# Altium schematic sheet Motor Encoder+Driver.schdoc
size 285 x 152 mm
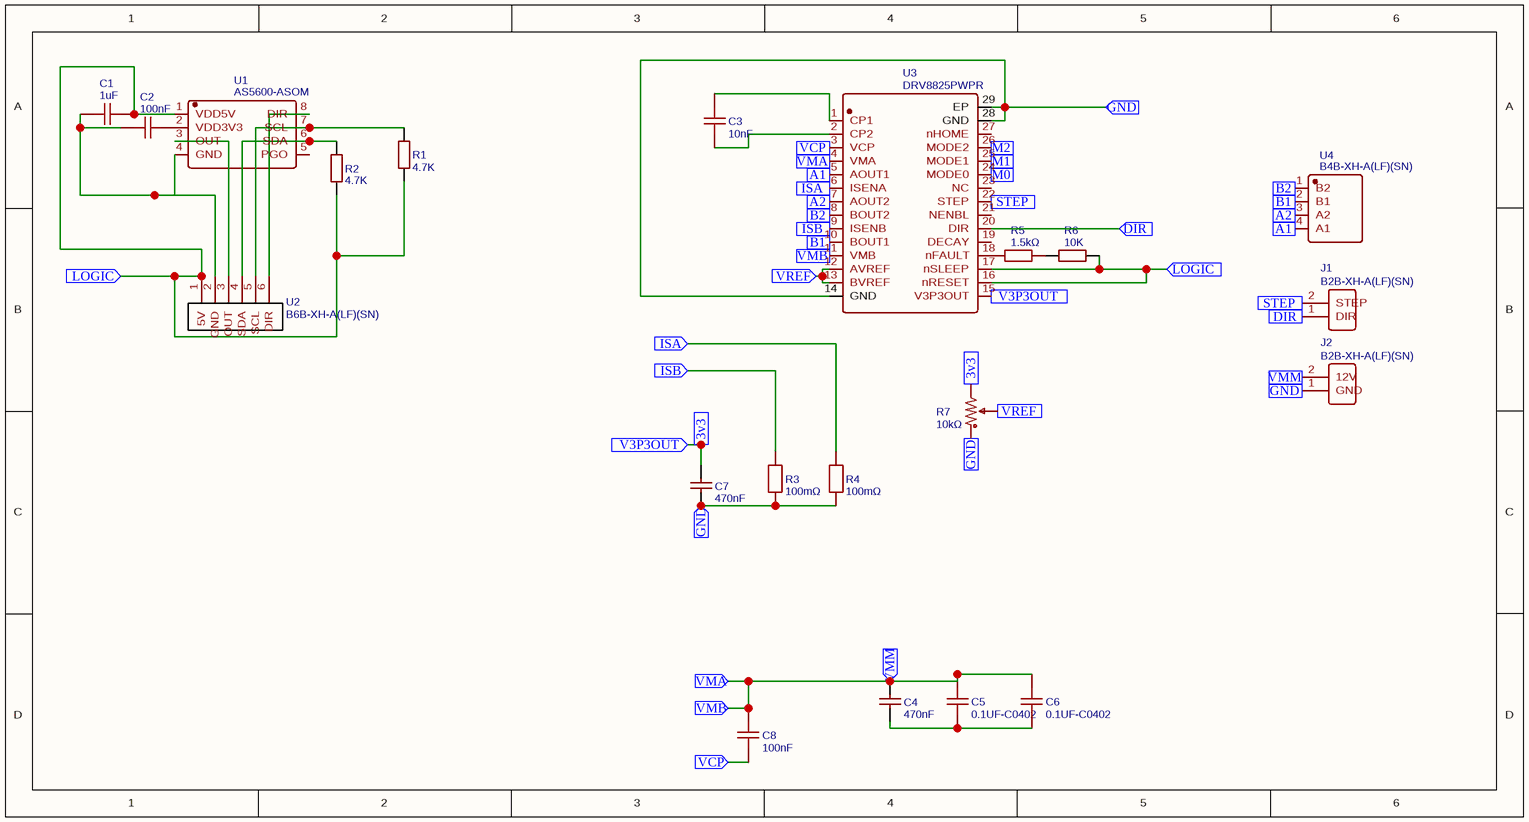
[diagram p0: Motor Encoder+Driver.schdoc]

## Parts
C1  1uF  [C0402]
C2  100nF  [C0402]
C3  10nF  [C0402]
C4  470nF  [C0402]
C5  0.1UF-C0402  [C0402]
C6  0.1UF-C0402  [C0402]
C7  470nF  [C0402]
C8  100nF  [C0402]
J1  B2B-XH-A(LF)(SN)  [CONN-TH_2P-P2.50_B2B-XH-A(LF)(SN)]
J2  B2B-XH-A(LF)(SN)  [CONN-TH_2P-P2.50_B2B-XH-A(LF)(SN)]
R1  4.7K  [R0603]
R2  4.7K  [R0603]
R3  100mΩ  [R0603]
R4  100mΩ  [R0603]
R5  1.5kΩ  [R0603]
R6  10K  [R0603]
R7  10kΩ  [RES-ADJ-SMD_3P-L3.0-W3.8-P1.75-BR]
U1  AS5600-ASOM  [SOIC-8_L5.0-W4.0-P1.27-LS6.0-BL]
U2  B6B-XH-A(LF)(SN)  [CONN-TH_6P-P2.50_B6B-XH-A-LF-SN]
U3  DRV8825PWPR  [HTSSOP-28_L9.7-W4.4-P0.65-LS6.4-BL-EP]
U4  B4B-XH-A(LF)(SN)  [CONN-TH_B4B-XH-A-LF-SN]

## Ports
3v3 (in), A1 (in), A2 (in), B1 (in), B2 (in), DIR (in), GND (in), ISA (in), ISB (in), LOGIC (in), M0 (in), M1 (in), M2 (in), STEP (in), V3P3OUT (in), VCP (in), VMA (in), VMB (in), VMM (in), VREF (in)

## Nets
3v3: C7.2 R7.3 U3.15(V3P3OUT) ; port 3v3, port V3P3OUT
A1: U3.5(AOUT1) U4.4(A1) ; port A1
A2: U3.7(AOUT2) U4.3(A2) ; port A2
B1: U3.10(BOUT1) U4.2(B1) ; port B1
B2: U3.8(BOUT2) U4.1(B2) ; port B2
DIR: J1.1(DIR) U3.20(DIR) ; port DIR
GND: C7.1 J2.1(GND) R3.1 R4.1 R7.1 U3.14(GND) U3.28(GND) U3.29(EP) ; port GND
ISA: R4.2 U3.6(ISENA) ; port ISA
ISB: R3.2 U3.9(ISENB) ; port ISB
LOGIC: C1.2 R1.2 R2.1 R6.2 U1.1(VDD5V) U2.1(5V) U3.16(nRESET) U3.17(nSLEEP) ; port LOGIC
M0: U3.24(MODE0) ; port M0
M1: U3.25(MODE1) ; port M1
M2: U3.26(MODE2) ; port M2
STEP: J1.2(STEP) U3.22(STEP) ; port STEP
VCP: C8.2 U3.3(VCP) ; port VCP
VMA: C4.2 C5.1 C6.1 C8.1 J2.2(12V) U3.4(VMA) U3.11(VMB) ; port VMM, port VMB, port VMA
VREF: R7.2 U3.12(AVREF) U3.13(BVREF) ; port VREF
NetC1_1: C1.1 C2.1 U1.4(GND) U2.2(GND)
NetC2_2: C2.2 U1.2(VDD3V3)
NetC3_1: C3.1 U3.2(CP2)
NetC3_2: C3.2 U3.1(CP1)
NetC4_1: C4.1 C5.2 C6.2
NetR1_1: R1.1 U1.7(SCL) U2.5(SCL)
NetR2_2: R2.2 U1.6(SDA) U2.4(SDA)
NetR5_1: R5.1 U3.18(nFAULT)
NetR5_2: R5.2 R6.1
NetU1_3: U1.3(OUT) U2.3(OUT)
NetU1_8: U1.8(DIR) U2.6(DIR)

Not connected (* = marked no-connect by the designer): U1 5(PGO); U3 19(DECAY) 21(NENBL) 23(NC) 27(nHOME)

## Library data of the parts
C1 = 1uF: BOM_Manufacturer: muRata(村田); BOM_Manufacturer Part: GRT155R60J105KE01D; nameAlias: Capacitance; Contributor: LCSC; BOM_Supplier: LCSC; BOM_Supplier Part: C430715; BOM_JLCPCB Part Class: Extended Part; spicePre: C; spiceSymbolName: GRT155R60J105KE01D
C2 = 100nF: BOM_Manufacturer: TDK; BOM_Manufacturer Part: C1005JB1C104KT000F; Contributor: LCSC; nameAlias: Capacitance; BOM_Supplier: LCSC; BOM_Supplier Part: C694270; BOM_JLCPCB Part Class: Extended Part; spicePre: C; spiceSymbolName: C1005JB1C104KT000F
C3 = 10nF: BOM_Manufacturer: EYANG(宇阳科技); BOM_Manufacturer Part: C0402X7R103K500NTB; nameAlias: Capacitance; Contributor: LCSC; BOM_Supplier: LCSC; BOM_Supplier Part: C115670; BOM_JLCPCB Part Class: Extended Part; spicePre: C; spiceSymbolName: C0402X7R103K500NTB
C4 C7 = 470nF: BOM_Manufacturer: YAGEO(国巨); BOM_Manufacturer Part: CC0402KRX5R5BB474; nameAlias: Capacitance; BOM_Supplier: LCSC; BOM_Supplier Part: C107012; BOM_JLCPCB Part Class: Extended Part; spicePre: C; spiceSymbolName: CC0402KRX5R5BB474
C5 C6 = 0.1UF-C0402: BOM_Manufacturer: null; Contributor: LCSC; BOM_Supplier: LCSC; BOM_Supplier Part: C9900008998; BOM_Manufacturer Part: 0.1uF-c0402; BOM_JLCPCB Part Class: Extended Part; spicePre: C; spiceSymbolName: 0.1UF-C0402
C8 = 100nF: BOM_Manufacturer: YAGEO(国巨); BOM_Manufacturer Part: CC0402KRX7R7BB104; nameAlias: Capacitance; BOM_Supplier: LCSC; BOM_Supplier Part: C60474; BOM_JLCPCB Part Class: Extended Part; spicePre: C; spiceSymbolName: CC0402KRX7R7BB104
J1 J2 = B2B-XH-A(LF)(SN): BOM_Manufacturer: JST Sales America; BOM_Manufacturer Part: B4B-XH-A(LF)(SN); Contributor: geminisblack; BOM_Supplier: Digi-Key; BOM_Supplier Part: 455-2247-ND; spicePre: J; spiceSymbolName: B2B-XH-A(LF)(SN)
R1 R2 = 4.7K: BOM_Manufacturer: YAGEO(国巨); BOM_Manufacturer Part: RC0603FR-074K7L; nameAlias: Resistance (Ohms); Resistance: 4.7kΩ; BOM_Supplier: LCSC; BOM_Supplier Part: C99782; BOM_JLCPCB Part Class: Extended Part; spicePre: R; spiceSymbolName: RC0603FR-074K7L
R3 R4 = 100mΩ: BOM_Manufacturer: SEI(Stackpole Electronics Inc.); BOM_Manufacturer Part: CSR0603FKR100; Resistance (Ohms): 0.1; nameAlias: Resistance; Contributor: LCSC; BOM_Supplier: LCSC; BOM_Supplier Part: C346801; BOM_JLCPCB Part Class: Extended Part; spicePre: R; spiceSymbolName: CSR0603FKR100
R5 = 1.5kΩ: BOM_Manufacturer: Tyohm(幸亚电阻); BOM_Manufacturer Part: RMC06031.5K5%N; Resistance (Ohms): 1.5K; nameAlias: Resistance; Contributor: LCSC; BOM_Supplier: LCSC; BOM_Supplier Part: C269377; BOM_JLCPCB Part Class: Extended Part; spicePre: R; spiceSymbolName: RMC06031.5K5%N
R6 = 10K: BOM_Manufacturer: YAGEO(国巨); BOM_Manufacturer Part: AC0603FR-0710KL; nameAlias: Resistance (Ohms); Resistance: 10kΩ; BOM_Supplier: LCSC; BOM_Supplier Part: C116677; BOM_JLCPCB Part Class: Extended Part; spicePre: R; spiceSymbolName: AC0603FR-0710KL
R7 = 10kΩ: BOM_Manufacturer: BOURNS; BOM_Manufacturer Part: TC33X-2-103E; Contributor: LCSC; nameAlias: Resistance; BOM_Supplier: LCSC; BOM_Supplier Part: C719176; BOM_JLCPCB Part Class: Extended Part; spicePre: R; spiceSymbolName: TC33X-2-103E
U1 = AS5600-ASOM: BOM_Manufacturer: ams(艾迈斯半导体); BOM_Supplier: LCSC; BOM_Manufacturer Part: AS5600-ASOM; BOM_Supplier Part: C79815; BOM_JLCPCB Part Class: Extended Part; spicePre: U; spiceSymbolName: AS5600-ASOM
U2 = B6B-XH-A(LF)(SN): BOM_Manufacturer: JST; Contributor: LCSC; BOM_Supplier: LCSC; BOM_Supplier Part: C144397; BOM_Manufacturer Part: B6B-XH-A(LF)(SN); BOM_JLCPCB Part Class: Extended Part; spicePre: U; spiceSymbolName: B6B-XH-A(LF)(SN)
U3 = DRV8825PWPR: BOM_Manufacturer: TI(德州仪器); BOM_Supplier: LCSC; BOM_Manufacturer Part: DRV8825PWPR; BOM_Supplier Part: C81582; BOM_JLCPCB Part Class: Extended Part; spicePre: U; spiceSymbolName: DRV8825PWPR
U4 = B4B-XH-A(LF)(SN): BOM_Manufacturer: JST; Contributor: LCSC; BOM_Supplier: LCSC; BOM_Supplier Part: C144395; BOM_Manufacturer Part: B4B-XH-A(LF)(SN); BOM_JLCPCB Part Class: Extended Part; spicePre: U; spiceSymbolName: B4B-XH-A(LF)(SN)